# Altium schematic sheet MORPHEU.SchDoc
size A4; Organization1: VINCULADA AO EXÉRCITO BRASILEIRO; Organization2: FÁBRICA DE MATERIAL DE; Organization3: COMUNICAÇÕES E ELETRÔNICA; Organization0: INDÚSTRIA DE MATERIAL BÉLICO DO BRASIL
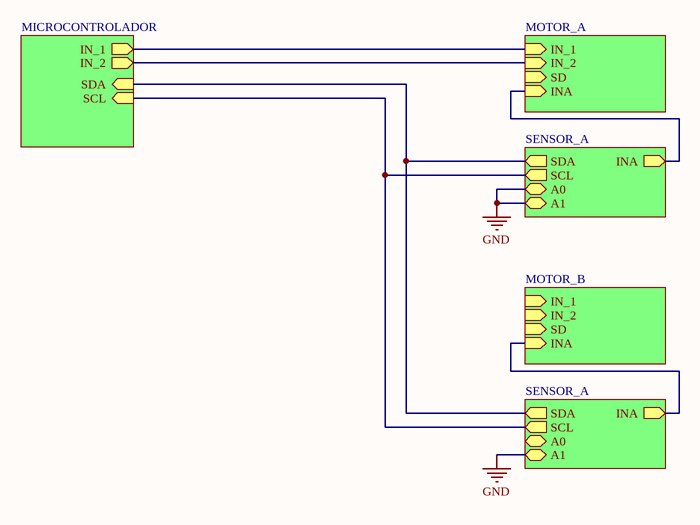
[diagram p0: MORPHEU.SchDoc]

## Sub-sheets
MICROCONTROLADOR = Driver Morpheu v4.0 CENTRAL.SchDoc: IN_2 (out), IN_1 (out), SDA (in), SCL (in)
MOTOR_A = Driver Morpheu v4.0 PONTE H.SchDoc: SD (in), IN_1 (in), INA (in), IN_2 (in)
MOTOR_B = Driver Morpheu v4.0 PONTE H.SchDoc: SD (in), IN_1 (in), INA (in), IN_2 (in)
SENSOR_A = Driver Morpheu v4.0 SENSOR CORRENTE.SchDoc: SDA (out), SCL (out), INA (out), A0, A1
SENSOR_A = Driver Morpheu v4.0 SENSOR CORRENTE.SchDoc: SDA (out), SCL (out), INA (out), A0, A1

## Nets
GND: sheet SENSOR_A/A0, sheet SENSOR_A/A1, sheet SENSOR_A/A1
(unnamed): sheet MICROCONTROLADOR/IN_2, sheet MOTOR_A/IN_2
(unnamed): sheet MICROCONTROLADOR/IN_1, sheet MOTOR_A/IN_1
(unnamed): sheet MICROCONTROLADOR/SDA, sheet SENSOR_A/SDA, sheet SENSOR_A/SDA
(unnamed): sheet MICROCONTROLADOR/SCL, sheet SENSOR_A/SCL, sheet SENSOR_A/SCL
(unnamed): sheet MOTOR_A/INA, sheet SENSOR_A/INA
(unnamed): sheet MOTOR_B/INA, sheet SENSOR_A/INA

## Notes on the sheet
- USADO EQUIP.:
- DATA:
- ENG:
- HORA:
- APROV._______
- REV:
- TÍTULO:
- FOLHA:
- /
- FORMATO:
- A4
- CÓDIGO:
- ESTOQUE: